# EAGLE schematic 2.2 (EAGLE 8.2.2)
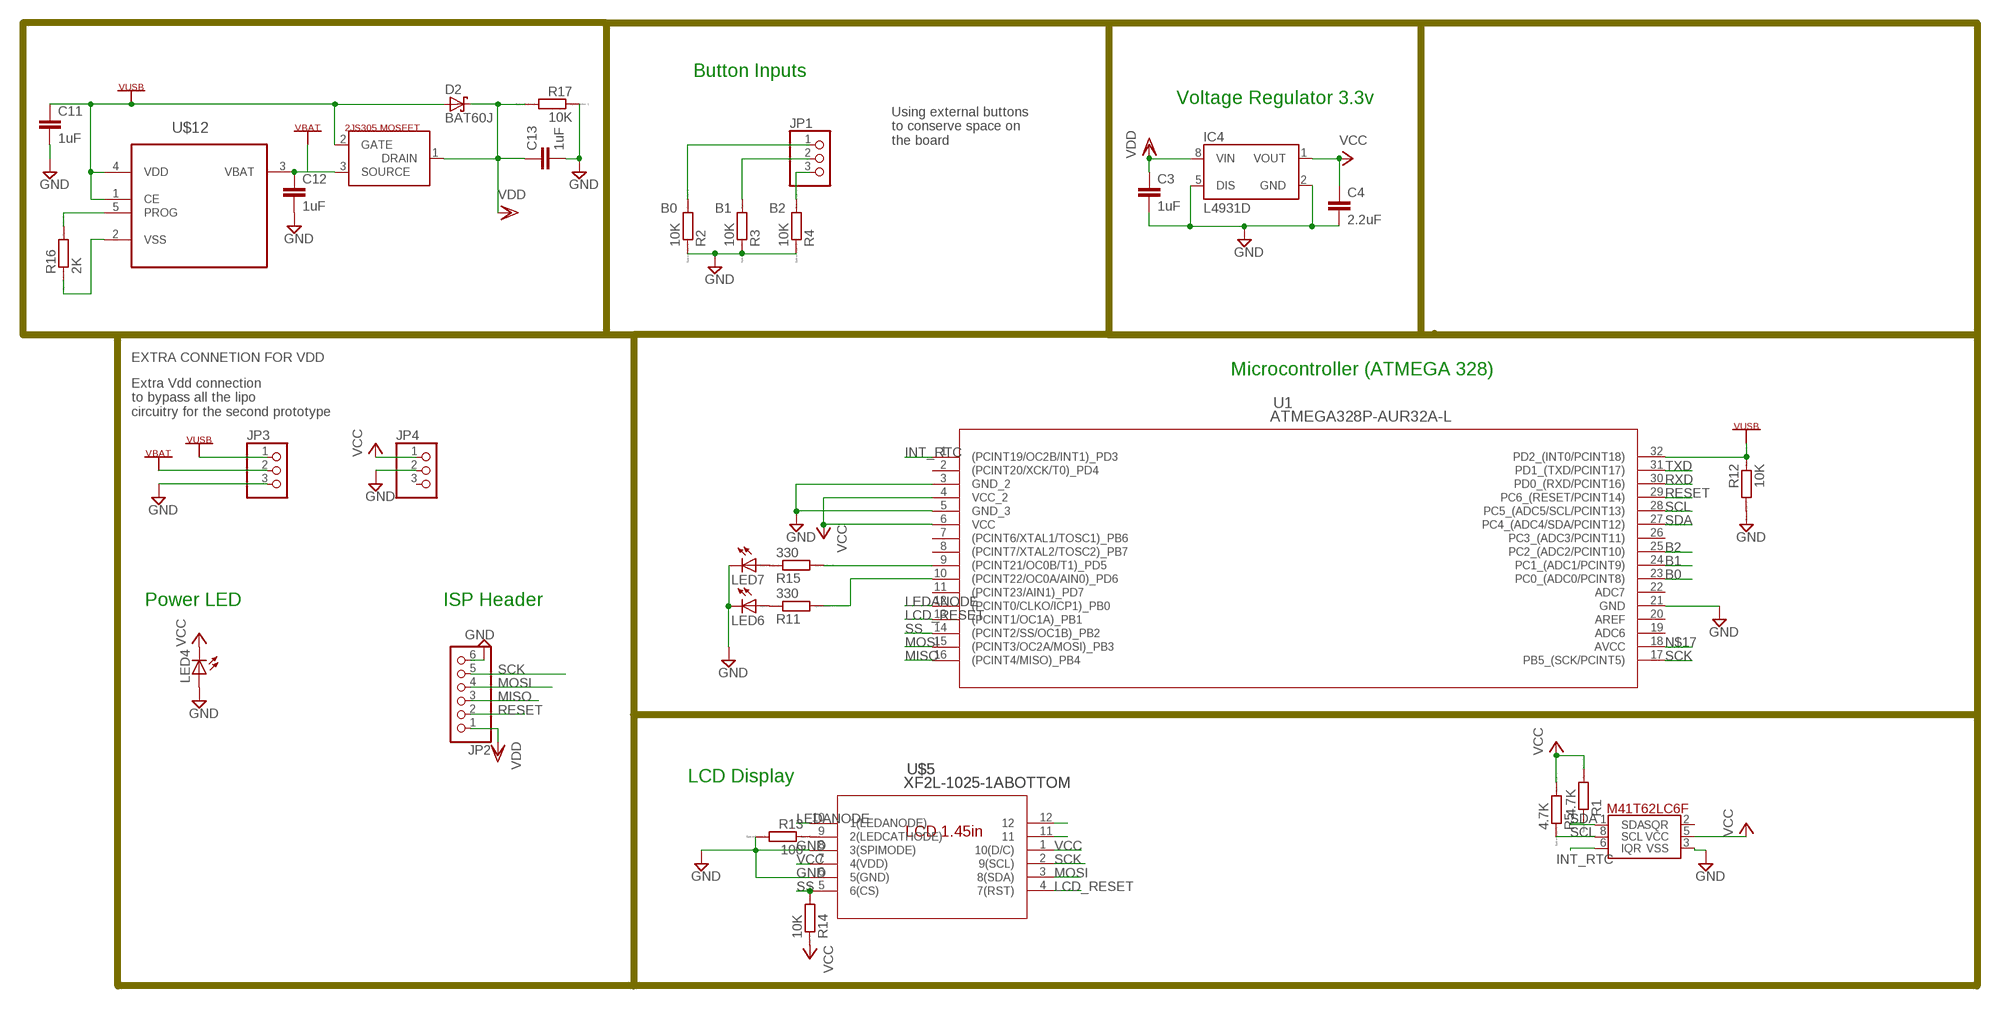
[diagram p0: schematic, sheet 1, part 1 of 2]
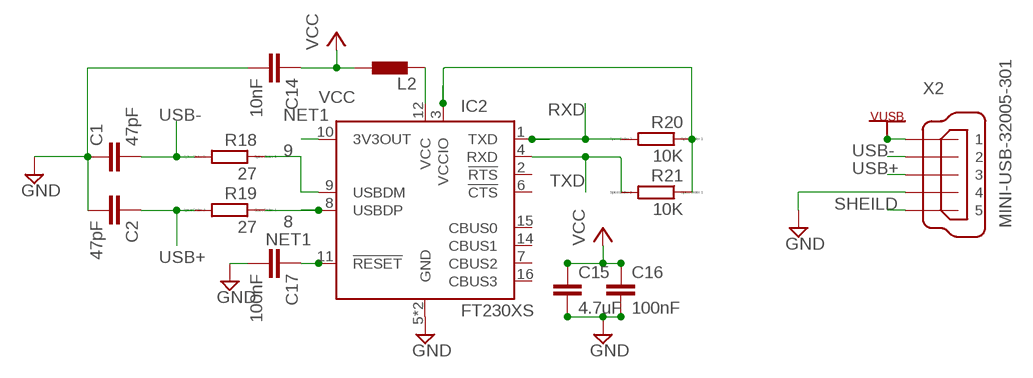
[diagram p1: schematic, sheet 1, part 2 of 2]

## Parts
C1  47pF  C-EUC0603K  [C0603K]
C2  47pF  C-EUC0603K  [C0603K]
C3  1uF  C-EUC0603K  [C0603K]
C4  2.2uF  C-EUC0603K  [C0603K]
C11  1uF  C-EUC0603K  [C0603K]
C12  1uF  C-EUC0603K  [C0603K]
C13  1uF  C-EUC0603K  [C0603K]
C14  10nF  C-EUC0603K  [C0603K]
C15  4.7uF  C-EUC0603K  [C0603K]
C16  100nF  C-EUC0603K  [C0603K]
C17  100nF  C-EUC0603K  [C0603K]
D2  BAT60J  [SOD323_ST]
IC2  FT230XS  [SSOP16]
IC4  L4931D  [SO08]
JP1  PINHD-1X3CB  [1X03-CLEANBIG]
JP2  PINHD-1X6B  [1X06-BIG]
JP3  PINHD-1X3CB  [1X03-CLEANBIG]
JP4  PINHD-1X3CB  [1X03-CLEANBIG]
L2  BLM15HB221SN1  [0402]
LED4  LEDSMT1206  [1206]
LED6  LEDSMT1206  [1206]
LED7  LEDSMT1206  [1206]
R1  4.7K  RR0603  [R0603]
R2  10K  RR0603  [R0603]
R3  10K  RR0603  [R0603]
R4  10K  RR0603  [R0603]
R5  4.7K  RR0603  [R0603]
R11  330  RR0603  [R0603]
R12  10K  RR0603  [R0603]
R13  100  RR0603  [R0603]
R14  10K  RR0603  [R0603]
R15  330  RR0603  [R0603]
R16  2K  RR0603  [R0603]
R17  10K  RR0603  [R0603]
R18  27  RR0603  [R0603]
R19  27  RR0603  [R0603]
R20  10K  RR0603  [R0603]
R21  10K  RR0603  [R0603]
U1  ATMEGA328P-AUR32A-L  [32A-L]
U$1  M41T62LC6F  [LCC-8]
U$5  XF2L-1025-1ABOTTOM  [CON10_1X10_DBR_XF2L]
U$12  MCP73812T-420I/OT  [SOT95P270X145-5N]
U$13  2JS305  [SOT346-R]
X2  MINI-USB-32005-301  [32005-301]

## Nets
8: IC2.8(USBDP) R19.1
9: IC2.9(USBDM) R18.1
B0: JP1.1 R2.2 U1.23(PC0_(ADC0/PCINT8))
B1: JP1.2 R3.2 U1.24(PC1_(ADC1/PCINT9))
B2: JP1.3 R4.2 U1.25(PC2_(ADC2/PCINT10))
GND: C1.1 C2.2 C3.2 C4.2 C11.2 C12.2 C13.2 C14.2 C15.2 C16.2 C17.2 IC2.5(GND) IC2.13(GND) IC4.2(GND) IC4.5(DIS) JP2.6 JP3.3 JP4.2 LED4.A LED6.C LED7.C R2.1 R3.1 R4.1 R12.2 R13.2 R17.1 U1.3(GND_2) U1.5(GND_3) U1.21(GND) U$1.3(VSS) U$5.6(5(GND)) U$5.8(3(SPIMODE)) X2.4
INT_RTC: U1.1((PCINT19/OC2B/INT1)_PD3) U$1.6(IQR)
LCD_RESET: U1.13((PCINT1/OC1A)_PB1) U$5.4(7(RST))
LEDANODE: U1.12((PCINT0/CLKO/ICP1)_PB0) U$5.10(1(LEDANODE))
MISO: JP2.3 U1.16((PCINT4/MISO)_PB4)
MOSI: JP2.4 U1.15((PCINT3/OC2A/MOSI)_PB3) U$5.3(8(SDA))
N$1: R13.1 U$5.9(2(LEDCATHODE))
N$2: IC2.12(VCC) L2.1
N$3: R15.2 U1.9((PCINT21/OC0B/T1)_PD5)
N$5: R16.2 U$12.5(PROG)
N$6: R16.1 U$12.2(VSS)
N$12: LED6.A R11.1
N$13: LED7.A R15.1
N$16: R11.2 U1.10((PCINT22/OC0A/AIN0)_PD6)
N$17: U1.18(AVCC)
N$26: U$5.12
N$27: U$5.11
NET1: C17.1 IC2.3(VCCIO) IC2.10(3V3OUT) IC2.11(!RESET) R20.1 R21.1
RESET: JP2.2 U1.29(PC6_(RESET/PCINT14))
RXD: IC2.1(TXD) R20.2 U1.30(PD0_(RXD/PCINT16))
SCK: JP2.5 U1.17(PB5_(SCK/PCINT5)) U$5.2(9(SCL))
SCL: R5.1 U1.28(PC5_(ADC5/SCL/PCINT13)) U$1.8(SCL)
SDA: R1.1 U1.27(PC4_(ADC4/SDA/PCINT12)) U$1.1(SDA)
SHEILD: X2.5
SS: R14.2 U1.14((PCINT2/SS/OC1B)_PB2) U$5.5(6(CS))
TXD: IC2.4(RXD) R21.2 U1.31(PD1_(TXD/PCINT17))
USB+: C2.1 R19.2 X2.3
USB-: C1.2 R18.2 X2.2
VBAT: C12.1 JP3.2 U$12.3(VBAT) U$13.3(SOURCE)
VCC: C4.1 C14.1 C15.1 C16.1 IC4.1(VOUT) JP4.1 L2.2 LED4.C R1.2 R5.2 R14.1 U1.4(VCC_2) U1.6(VCC) U$1.5(VCC) U$5.1(10(D/C)) U$5.7(4(VDD))
VDD: C3.1 C13.1 D2.C IC4.8(VIN) JP2.1 R17.2 U$13.1(DRAIN)
VUSB: C11.1 D2.A JP3.1 R12.1 U1.32(PD2_(INT0/PCINT18)) U$12.1(CE) U$12.4(VDD) U$13.2(GATE) X2.1
Unconnected: IC2.2(!RTS) IC2.6(!CTS) IC2.7(CBUS2) IC2.14(CBUS1) IC2.15(CBUS0) IC2.16(CBUS3) JP4.3 U1.2((PCINT20/XCK/T0)_PD4) U1.7((PCINT6/XTAL1/TOSC1)_PB6) U1.8((PCINT7/XTAL2/TOSC2)_PB7) U1.11((PCINT23/AIN1)_PD7) U1.19(ADC6) U1.20(AREF) U1.22(ADC7) U1.26(PC3_(ADC3/PCINT11)) U$1.2(SQR)

## Notes on the sheet
- Button Inputs
- Voltage Regulator 3.3v
- Using external buttons 
  to conserve space on 
  the board
- EXTRA CONNETION FOR VDD
- Microcontroller (ATMEGA 328)
- Extra Vdd connection 
  to bypass all the lipo
  circuitry for the second prototype
- Power LED | ISP Header
- LCD Display

## Library data of the parts
C1-C4 C11-C17 = rcl:C-EU: CAPACITOR, European symbol
D2 = diode:BAT60J: Schottky barrier diode Source: www.st.com, BAT60J.pdf
IC2 = ft230x_10:FT230X: USB to Basic UART IC Source: http://www.ftdichip.com/Support/Documents/DataSheets/ICs/DS_FT230X.pdf; MF: FTDI; MPN: FT230XS; OC_FARNELL: 2081321; OC_NEWARK: 83T7087
IC4 = v-reg-3:L4931: STMicroelectronics <http://www.st.com> 250mA low dropout voltage regulator Vin 5V to 28V (transients 40V), disable pin, 50µA shutdown current
JP1 JP3 JP4 = adafruit:PINHD-1X3: PIN HEADER
JP2 = adafruit:PINHD-1X6: PIN HEADER
L2 = inductors:BLM15H: EMIFIL (R) Chip Ferrite Bead for GHz Noise Source: http://www.murata.com/ Ferrite Bead BLM15H.pdf
LED4 LED6 LED7 = adafruit:LED: LED OSRAM: - CHIPLED LG R971, LG N971, LY N971, LG Q971, LY Q971, LO R971, LY R971 LH N974, LH R974 LS Q976, LO Q976, LY Q976 LO Q996 - Hyper CHIPLED LW Q18S LB Q993, LB Q99A, LB R99A - SideLED LS A670, LO A670, LY A670, LG A670, LP A670 LB A673, LV A673, LT A673, LW A673 LH A674 LY A675 LS A676, LA A676, LO A676, LY A676, LW A676 LS A679, LY A679, LG A679 - Hyper Micro SIDELED® LS Y876, LA Y876, LO Y876, LY Y876 LT Y87S - SmartLED LW L88C, LW L88S LB L89C, LB L89S, LG L890 LS L89K, LO L89K, LY L89K LS L896, LA L896, LO L896, LY L896 - TOPLED LS T670, LO T670, LY T670, LG T670, LP T670 LSG T670, LSP T670, LSY T670, LOP T670, LYG T670 LG T671, LOG T671, LSG T671 LB T673, LV T673, LT T673, LW T673 LH T674 LS T676, LA T676, LO T676, LY T676, LB T676, LH T676, LSB T676, LW T676 LB T67C, LV T67C, LT T67C, LS T67K, LO T67K, LY T67K, LW E67C LS E67B, LA E67B, LO E67B, LY E67B, LB E67C, LV E67C, LT E67C LW T67C LS T679, LY T679, LG T679 LS T770, LO T770, LY T770, LG T770, LP T770 LB T773, LV T773, LT T773, LW T773 LH T774 LS E675, LA E675, LY E675, LS T675 LS T776, LA T776, LO T776, LY T776, LB T776 LHGB T686 LT T68C, LB T68C - Hyper Mini TOPLED® LB M676 - Mini TOPLED Santana® LG M470 LS M47K, LO M47K, LY M47K Source: http://www.osram.convergy.de/
R1-R5 R11-R17 R19-R21 = eagle-ltspice:R: RESISTOR, European symbol; SPICEMODEL: NONE; SPICEPREFIX: R
R18 = eagle-ltspice:R: RESISTOR, European symbol; SPICEMODEL: NONE; SPICEPREFIX: R6
U1 = MyParts:ATMEGA328P-AUR; MANUFACTURER_PART_NUMBER: ATMEGA328PAUR; VENDOR: Atmel
U$1 = MyParts:M41T62LC6F
U$5 = MyParts:XF2L-1025-1ABOTTOM
U$12 = Microchip_By_element14_Batch_1:MCP73812T-420I/OT: Charge Management Controller; MPN: MCP73812T-420I/OT; OC_FARNELL: 1627187; OC_NEWARK: 27M0232; PACKAGE: SOT-5; SUPPLIER: Microchip
U$13 = SOT346-R:2JS305
X2 = con-cypressindustries:MINI-USB-: MINI USB-B Conector Source: www.cypressindustries.com; OC_FARNELL: unknown; OC_NEWARK: unknown

## Module USBTOSERIAL
Ports: 

### Library data of the parts